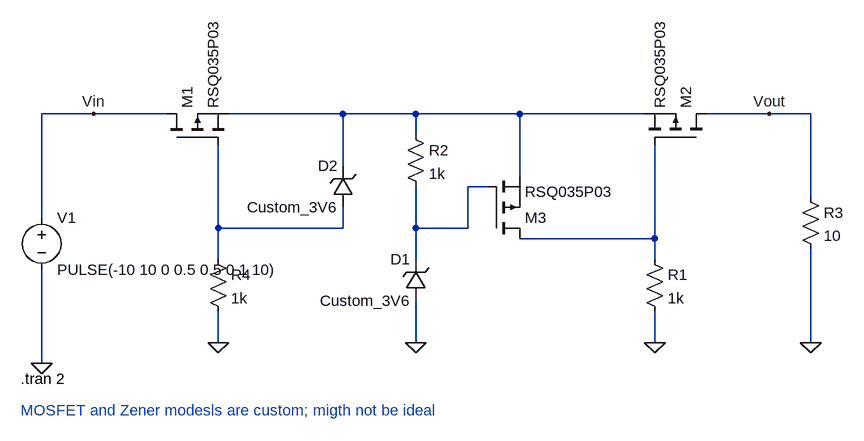
[diagram p0: schematic PROTECTIONS.asc]
PROTECTIONS.asc, the LTspice schematic file:
Version 4
SHEET 1 880 680
WIRE -416 64 -496 64
WIRE -304 64 -416 64
WIRE -32 64 -208 64
WIRE 80 64 -32 64
WIRE 240 64 80 64
WIRE 432 64 240 64
WIRE 624 64 528 64
WIRE 688 64 624 64
WIRE 80 96 80 64
WIRE -32 144 -32 64
WIRE 240 160 240 64
WIRE 192 176 160 176
WIRE 688 192 688 64
WIRE -496 224 -496 64
WIRE -224 240 -224 112
WIRE -32 240 -32 208
WIRE -32 240 -224 240
WIRE 80 240 80 176
WIRE 160 240 160 176
WIRE 160 240 80 240
WIRE 448 256 448 112
WIRE 448 256 240 256
WIRE -224 288 -224 240
WIRE 80 288 80 240
WIRE 448 288 448 256
WIRE -224 416 -224 368
WIRE 80 416 80 352
WIRE 448 416 448 368
WIRE 688 416 688 272
WIRE -496 448 -496 304
FLAG 448 416 0
FLAG 80 416 0
FLAG 688 416 0
FLAG -496 448 0
FLAG -224 416 0
FLAG 624 64 Vout
FLAG -416 64 Vin
SYMBOL pmos 528 112 M270
SYMATTR InstName M2
SYMATTR Value RSQ035P03
SYMBOL res 432 272 R0
SYMATTR InstName R1
SYMATTR Value 1k
SYMBOL res 64 80 R0
SYMATTR InstName R2
SYMATTR Value 1k
SYMBOL zener 96 352 R180
WINDOW 0 24 64 Left 2
WINDOW 3 24 0 Left 2
SYMATTR InstName D1
SYMATTR Value Custom_3V6
SYMBOL res 672 176 R0
SYMATTR InstName R3
SYMATTR Value 10
SYMBOL voltage -496 208 R0
WINDOW 123 0 0 Left 0
WINDOW 39 0 0 Left 0
SYMATTR InstName V1
SYMATTR Value PULSE(-10 10 0 0.5 0.5 0 1 10)
SYMBOL pmos 192 256 M180
SYMATTR InstName M3
SYMATTR Value RSQ035P03
SYMBOL pmos -304 112 R270
SYMATTR InstName M1
SYMATTR Value RSQ035P03
SYMBOL res -240 272 R0
SYMATTR InstName R4
SYMATTR Value 1k
SYMBOL zener -16 208 R180
WINDOW 0 24 64 Left 2
WINDOW 3 24 0 Left 2
SYMATTR InstName D2
SYMATTR Value Custom_3V6
TEXT -528 472 Left 2 !.tran 2
TEXT -528 520 Left 2 ;MOSFET and Zener modesls are custom; migth not be ideal

The netlist it stands for:
* PROTECTIONS.asc
M2 Vout N004 N001 N001 RSQ035P03
R1 N004 0 1k
R2 N001 N002 1k
D1 0 N002 Custom_3V6
R3 Vout 0 10
V1 Vin 0 PULSE(-10 10 0 0.5 0.5 0 1 10)
M3 N004 N002 N001 N001 RSQ035P03
M1 Vin N003 N001 N001 RSQ035P03
R4 N003 0 1k
D2 N003 N001 Custom_3V6
.model D D
.lib standard.dio
.model NMOS NMOS
.model PMOS PMOS
.lib standard.mos
.tran 2
* MOSFET and Zener modesls are custom; migth not be ideal
.backanno
.end